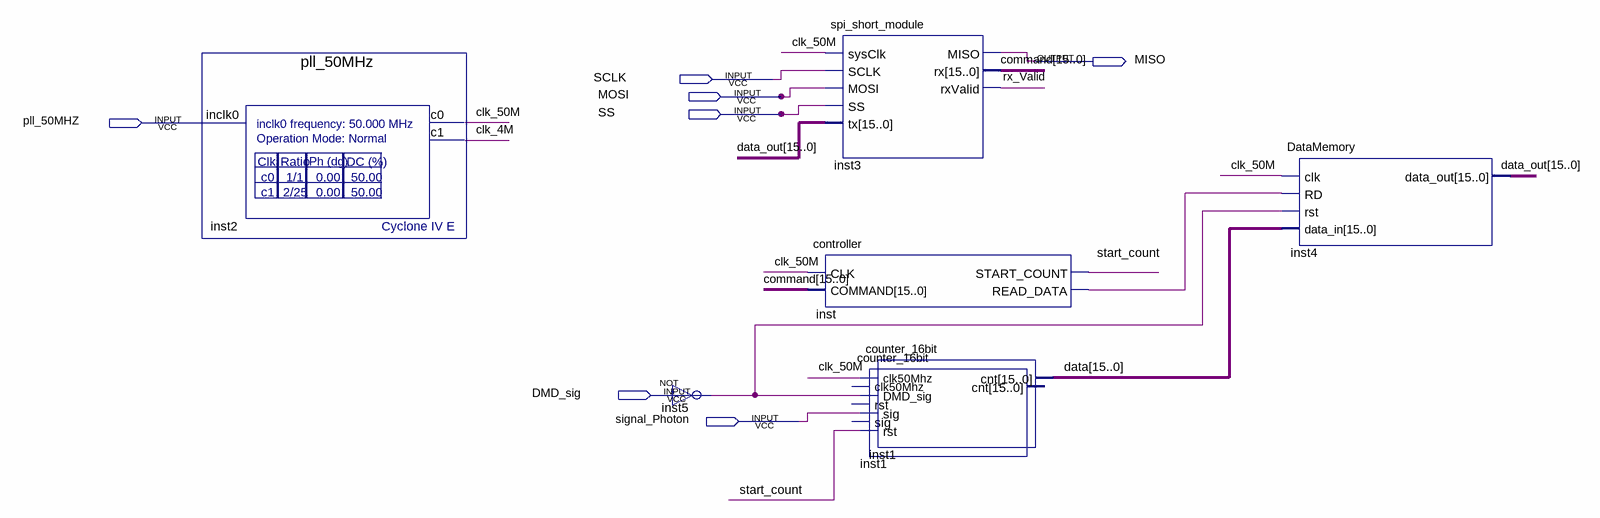
[diagram p0: schematic sheet]
// Quartus schematic counter_fpga_image.bdf as structural Verilog: 7 symbols, 7 pins
module counter_fpga_image (
  input  SCLK,
  input  MOSI,
  input  SS,
  input  pll_50MHZ,
  input  DMD_sig,
  input  signal_Photon,
  output MISO
);

  wire clk_4M, clk_50M, inst_read_data, rx_Valid, start_count;
  wire [15:0] command, data, data_out;

  pll_50MHz inst2 (.inclk0(pll_50MHZ), .c0(clk_50M), .c1(clk_4M));
  // NOT inst5 has open pins: IN=open, OUT=DMD_sig
  spi_short_module inst3 (
    .sysClk(clk_50M), .SCLK(SCLK), .MOSI(MOSI), .SS(SS), .tx(data_out), .MISO(MISO), .rx(command),
    .rxValid(rx_Valid));
  controller inst (.CLK(clk_50M), .COMMAND(command), .START_COUNT(start_count), .READ_DATA(inst_read_data));
  counter_16bit inst1 (.clk50Mhz(clk_50M), .DMD_sig(DMD_sig), .sig(signal_Photon), .rst(start_count), .cnt(data));
  counter_16bit inst1_dup2 ();  // open: clk50Mhz, rst, sig, cnt
  DataMemory inst4 (.clk(clk_50M), .RD(inst_read_data), .rst(DMD_sig), .data_in(data), .data_out(data_out));
endmodule
